# Altium schematic sheet REGULACION.SchDoc
size A4; SheetNumber: 3; SheetTotal: 3
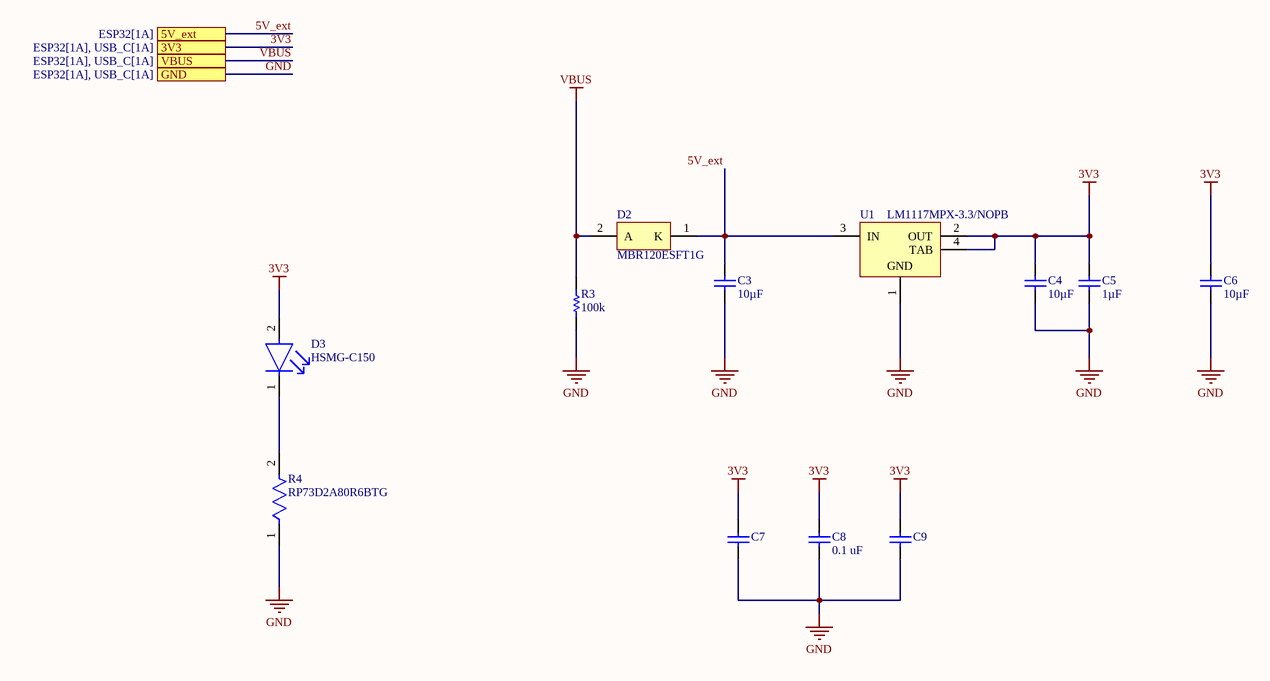
[diagram p0: REGULACION.SchDoc]

## Parts
C3  10µF  [CAPC2013X140X50ML20T25]
C4  10µF  [CAPC2013X140X50ML20T25]
C5  1µF  [CAPC2013X145X50ML20T25]
C6  10µF  [CAPC2013X140X50ML20T25]
C7  C0805C106K4PACTU  [CAPC2013X140X50ML20T25]  (value not drawn)
C8  0.1 uF  [CAPC2013X94X50ML20T25]
C9  C0805C106K4PACTU  [CAPC2013X140X50ML20T25]  (value not drawn)
D2  MBR120ESFT1G  [ONSC-SOD-123FL-2-498_V]
D3  HSMG-C150  [FP-HSMG-C150-MFG]
R3  100k  [RESC2013X60X40ML20T25]
R4  RP73D2A80R6BTG  [FP-RP732A-IPC_A]
U1  LM1117MPX-3.3/NOPB  [DCY0004A_M]

## Ports
3V3 (see ESP32[1A], USB_C[1A]), 5V_ext (see ESP32[1A]), GND (see ESP32[1A], USB_C[1A]), VBUS (see ESP32[1A], USB_C[1A])

## Nets
3V3: C4.2 C5.2 C6.2 C7.2 C8.2 C9.2 D3.2(A) U1.2(OUT) U1.4(TAB) ; port 3V3
GND: C3.1 C4.1 C5.1 C6.1 C7.1 C8.1 C9.1 R3.1 R4.1 U1.1(GND) ; port GND
VBUS: D2.2(A) R3.2 ; port VBUS
5V_ext: C3.2 D2.1(K) U1.3(IN) ; port 5V_ext
NetD3_1: D3.1(C) R4.2

## Library data of the parts
C3 C4 C6 C7 C9 = CMP-2007-03242-1: 10µF ±10% 16V Ceramic Capacitor X5R 0805 (2012 Metric); Part Number: CL21A106KOQNNNG
C5 = CMP-2007-01082-1: 1µF ±10% 16V Ceramic Capacitor X7R 0805 (2012 Metric); Manufacturer: Kemet; Part Number: C0805C105K4RAC7800
C8 = CMP-2000-05016-1: Chip Capacitor, Ceramic, 0.1 uF, 10%, 50 V, 0805, RoHS, Tape and Reel; Manufacturer: AVX; Rated Voltage: 50V; Capacitance: 100nF; Dielectric: X7R; Case Size/Dimension: 0805; Tolerance (%): ±10%; Datasheet URL: http://www.farnell.com/datasheets/319609.pdf; Datasheet Version: Sep-07; Manufacturer URL: http://www.avx.com/
D2 = CMP-1055-00434-1: Schottky Power Rectifier, 2-Pin SOD-123, Pb-Free, Tape and Reel; Manufacturer: On Semiconductor; Configuration: Single; IFSM Max (A): 40; ComponentLink2URL: http://www.onsemi.cn/pub_link/Collateral/MBR120ESFT1-D.PDF; PackageDescription: 2-Pin SOD, Body 1.65 x 2.7 mm; RoHS: TRUE; ComponentLink1URL: http://www.onsemi.com/; PackageVersion: Rev. D, 05/2013; PartNumber: MBR120ESFT1G; PackageReference: SOD-123FL-2-498; ComponentLink2Description: Datasheet; ComponentLink1Description: Manufacturer URL; DatasheetVersion: Rev. 4; ComponentLink3Description: Package Specification; ComponentLink3URL: http://www.onsemi.com/pub_link/Collateral/498-01.PDF; Mounting Technology: Surface Mount; Packing: Tape and Reel
D3 = CMP-2000-05061-2: LED GREEN DIFFUSED 1206 SMD; Manufacturer: Broadcom; Led Orientation: Top View; Max Junction Temp: +95°C; Peak Emmision Wavelength: 570nm; Viewing Angle: 170°; Wavelength: 572nm; Reverse Voltage: 5V; Luminous Intensity: 15mcd; Forward Voltage: 2.2V; Power Dissipation: 65mW; Forward Current: 20mA; ComponentLink2Description: Datasheet; Lead Free: Yes; Temperature Range Low: -40°C; Package: HSMG-C150; Digikey Description: LED GREEN DIFFUSED 1206 SMD; Mouser Description: LED Uni-Color Green 570nm 2-Pin Chip LED T/R; Manufacturer Part Number: HSMG-C150; Temperature Range High: +85°C; Device Class L1: Optoelectronics; Colour: Green; Category: Diode; Device Class L3: unset; RoHS: TRUE; Height: 1.2mm; ComponentLink2URL: https://docs.broadcom.com/docs/AV02-0551EN; Device Class L2: LEDs; Automotive: No; Ipc Land Pattern Name: DIOCP320160X55; Octopart: https://octopart.com/hsmg-c150-broadcom-71131304; Temperature: -40°C to +85°C
R3 = CMP-2001-00583-1: 100 kOhms ±0.1% 0.125W, 1/8W Chip Resistor 0805 (2012 Metric) Automotive AEC-Q200 Thin Film; Part Number: ERA6AEB104V; Manufacturer: Panasonic
R4 = CMP-03211-002377-1: RESISTOR, 0805 80.6Ω, 0.1% 15ppm/°C; Manufacturer: TE Connectivity; Power Rating: 0.125W; Voltage Rating: 150V; ComponentLink2URL: https://www.te.com/commerce/DocumentDelivery/DDEController?Action=srchrtrv&DocNm=1773272&DocType=DS&DocLang=English; Device Class L3: Chip SMD Resistors; Automotive: No; ComponentLink2Description: Datasheet; Series: RP73; Temperature Coefficient: 15ppm/°C; Octopart: https://octopart.com/rp73d2a80r6btg-te+connectivity-42011633; octopart_url: https://octopart.com/rp73d2a80r6btg-te+connectivity-42011633; Device Class L2: Resistors; Device Class L1: Passive Components; Value: 80.6Ω; Composition: Thin Film; Lead Free: Yes; Ipc Land Pattern Name: RESC200125X55; Resistance: 80.6Ω; Package: RP732A; packaging: 250 cut tape length; Height: 0.65mm; Tolerance: 0.1%; Manufacturer Part Number: RP73D2A80R6BTG; Temperature: -55°C to 155°C; Temperature Range High: 155°C; RoHS: TRUE; Category: Res; Temperature Range Low: -55°C
U1 = CMP-0062-01639-4: 800mA Low-Dropout Linear Regulator, 4-pin SOT-223, Pb-Free; Manufacturer: Texas Instruments; High-Reliability: Y; PowerWise: N; PackageTopMarking: XYTT*N05A; CompType: LDO IC; ComponentLink1URL: http://www.ti.com/general/docs/lit/getliterature.tsp?genericPartNumber=LM1117-N&fileType=pdf; PartNumber: LM1117MPX-3.3/NOPB; ComponentLink1Description: Datasheet URL; PinCount: 4; Code_JEDEC: TO-261-AA; PackageDescription: Molded SOT-223, 6.50 x 3.56 x 1.6mm Body, 4 Lead, 2.3mm Pitch; PackageReference: DCY0004A; RoHS: Y; Code_IPC: SOT223-4